# Altium schematic sheet 0_Architecture.SchDoc
size A4; Organization: SpaceLab UFSC; Address1: UFSC - SpaceLab; Address2: University Campus - Trindade; Address3: Dep. of Electrical Engineering - CTC; Address4: Florianópolis, Santa Catarina, Brazil; Address5: CEP: 88040 - 900
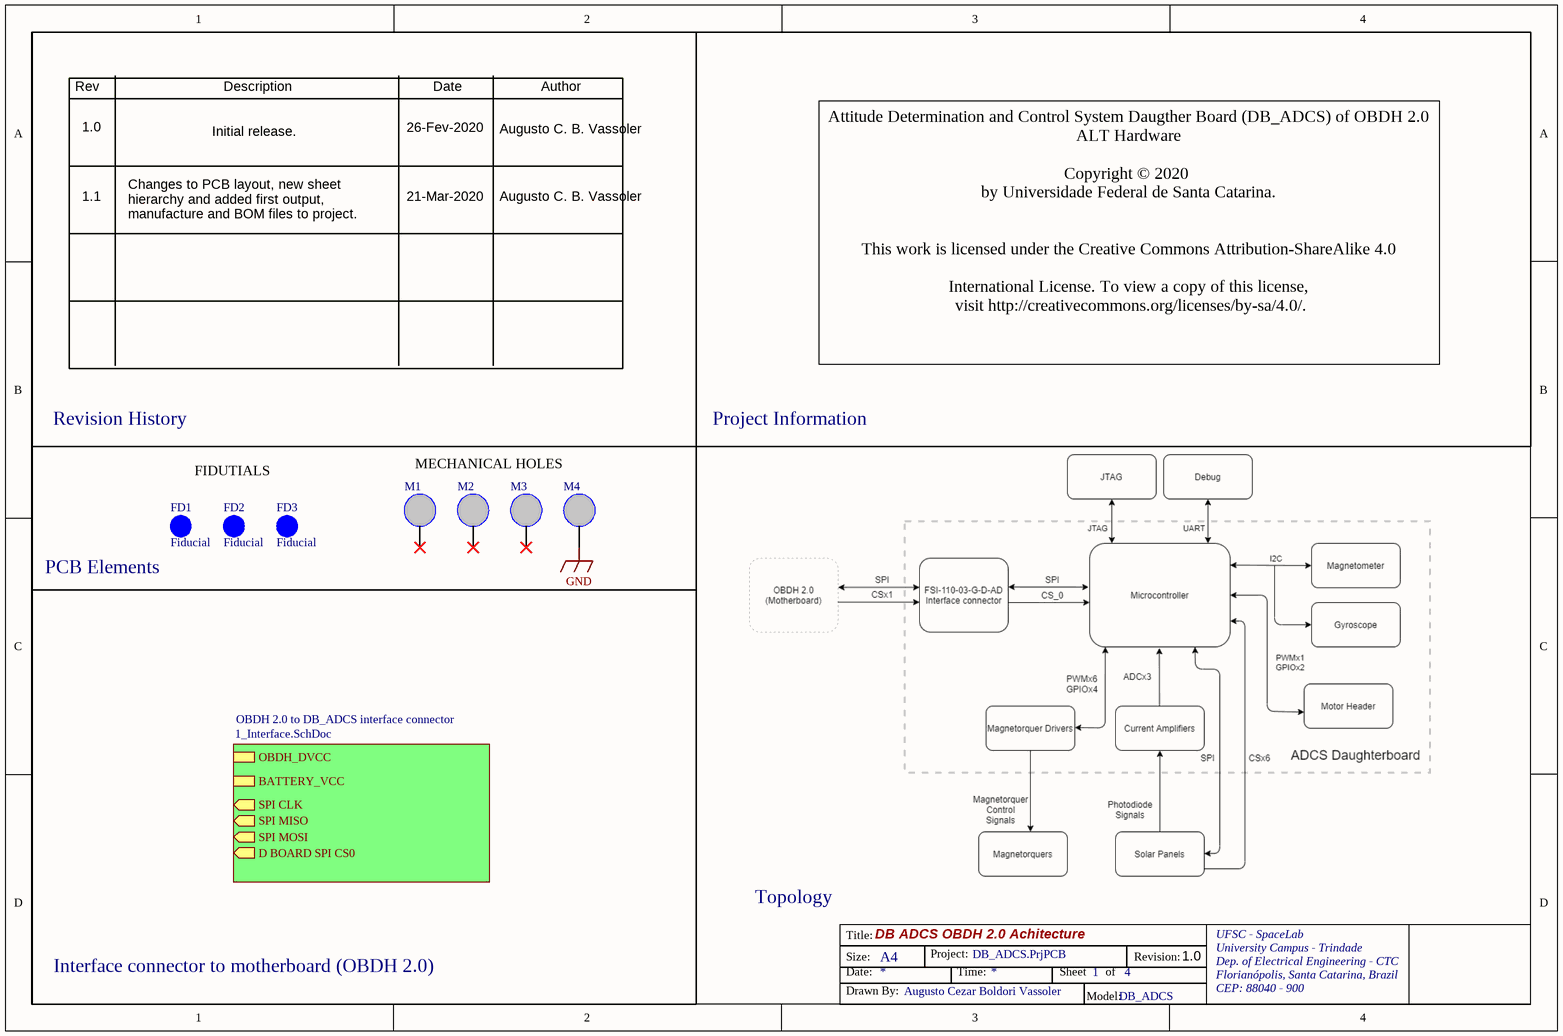
[diagram p0: 0_Architecture.SchDoc]

## Parts
FD1  Fiducial  [Fiducial 1.3mm]
FD2  Fiducial  [Fiducial 1.3mm]
FD3  Fiducial  [Fiducial 1.3mm]
M1  DB Mechanical Hole  [DB Mechanical Hole]  (value not drawn)
M2  DB Mechanical Hole  [DB Mechanical Hole]  (value not drawn)
M3  DB Mechanical Hole  [DB Mechanical Hole]  (value not drawn)
M4  DB Mechanical Hole  [DB Mechanical Hole]  (value not drawn)

## Sub-sheets
OBDH 2.0 to DB_ADCS interface connector = 1_Interface.SchDoc: OBDH_DVCC, D BOARD SPI CS0 (out), SPI CLK (out), SPI MISO (out), SPI MOSI (out), BATTERY_VCC

## Nets
GND: M4.0

Not connected (* = marked no-connect by the designer): M1 0*; M2 0*; M3 0*

## Notes on the sheet
- Rev
- Description
- Date
- Author
- 1.0
- Initial release.
- 26-Fev-2020
- Augusto C. B. Vassoler
- 1.1
- Changes to PCB layout, new sheet hierarchy and added first output, manufacture and BOM files to project.
- 21-Mar-2020
- Attitude Determination and Control System Daugther Board (DB_ADCS) of OBDH 2.0 ALT Hardware
  Copyright © 2020
  by Universidade Federal de Santa Catarina.
  This work is licensed under the Creative Commons Attribution-ShareAlike 4.0
  International License. To view a copy of this license,
  visit http://creativecommons.org/licenses/by-sa/4.0/.
  - Drawn by: Augusto Cezar Boldori Vassoler.
  - Reviewers: André Martins Pio de Mattos and Gabriel Mariano Marcelino.
  - Based on OBDH 2.0 designed by: André Martins Pio de Mattos.
- Revision History
- Project Information
- FIDUTIALS
- MECHANICAL HOLES
- (near FD1) PCB Elements
- Topology
- Interface connector to motherboard (OBDH 2.0)
- DB ADCS OBDH 2.0 Achitecture
- DB_ADCS.PrjPCB
- 1
- 4
- Augusto Cezar Boldori Vassoler
- DB_ADCS
- Title:
- Size:
- Date:
- A4
- Project:
- Time:
- Sheet
- of
- Revision:
- UFSC - SpaceLab
- University Campus - Trindade
- Dep. of Electrical Engineering - CTC
- Florianópolis, Santa Catarina, Brazil
- CEP: 88040 - 900
- Drawn By:
- Model:

## Library data of the parts
FD1-FD3 = Fiducial: Fiducial for DB board variants
M1-M4 = DB Mechanical Hole: Mechanical Hole for DB board variants